# Altium schematic sheet Board-RS485.SchDoc: =ProjectTitle
size 297 x 209 mm; Address1: Address1; Address2: Address2; Address3: Address3; Address4: Address4; SheetNumber: 2; SheetTotal: 6; Scale: 1:1; DocumentType: Схема электрическая принципиальная
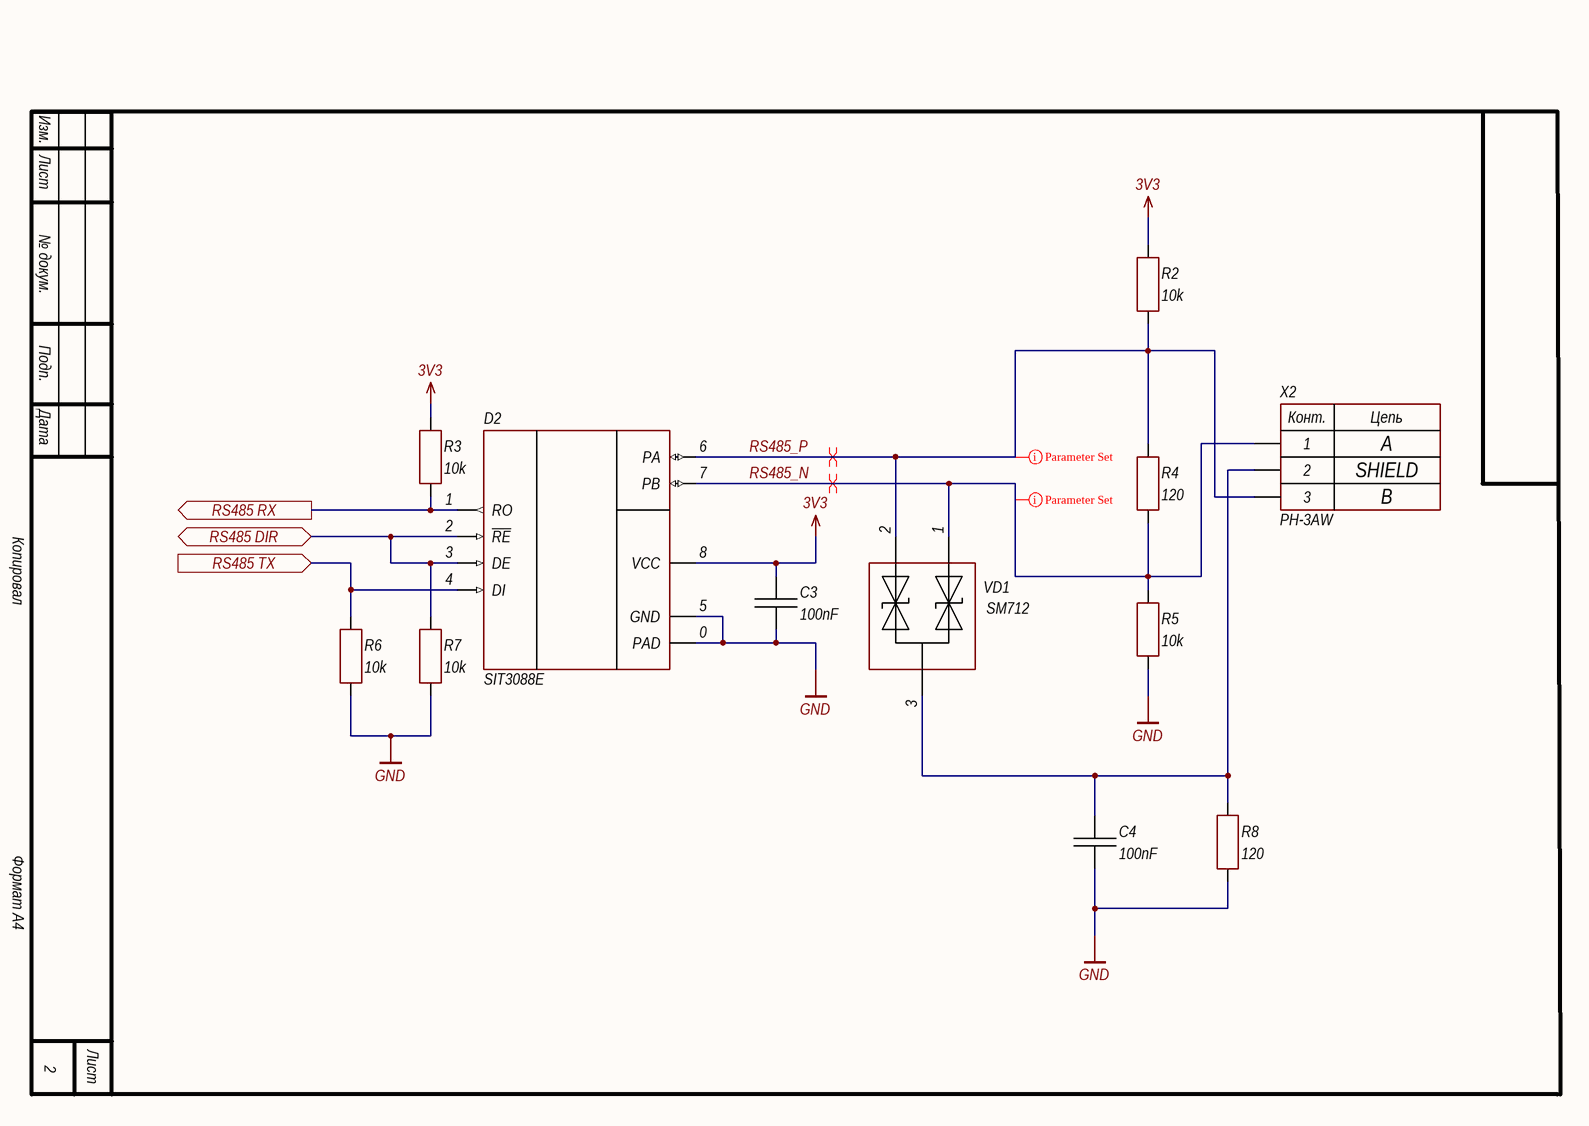
[diagram p0: Board-RS485.SchDoc]

## Parts
C3  100nF  [CH0402C]
C4  100nF  [CH0402C]
D2  SIT3088E  [8-DFN (3x3 mm, 0.65mm pitch)]
R2  10k  [CH0402R]
R3  10k  [CH0402R]
R4  120  [CH0402R]
R5  10k  [CH0402R]
R6  10k  [CH0402R]
R7  10k  [CH0402R]
R8  120  [CH0402R]
VD1  SM712  [SOT23_132]
X2  PH-3AW  [CON: PH-3AW]

## Ports
RS485 DIR (bidir), RS485 RX (out), RS485 TX (in)

## Nets
3V3: C3.2 D2.8(VCC) R2.2 R3.2
GND: C3.1 C4.1 D2.0(PAD) D2.5(GND) R5.1 R6.1 R7.1 R8.1
RS485 DIR: D2.2(~{RE}) D2.3(DE) R7.2 ; port RS485 DIR
RS485 RX: D2.1(RO) R3.1 ; port RS485 RX
RS485 TX: D2.4(DI) R6.2 ; port RS485 TX
RS485_N: D2.7(PB) R4.1 R5.2 VD1.1 X2.1
RS485_P: D2.6(PA) R2.1 R4.2 VD1.2 X2.3
NetC4_2: C4.2 R8.2 VD1.3 X2.2

## Layout directives
differential pair: RS485_N, RS485_P
rule Matched Net Lengths [Tolerance = 0.05mm]; net class RS485: RS485_N, RS485_P

## Notes on the sheet
- SHIELD
- A
- B
- Изм.
- Лист
- № докум.
- Подп.
- Дата
- Копировал
- Формат А4
- (in symbol 3-Connector) Конт.; Цепь

## Library data of the parts
C3 C4 = Capacitor: Manufacturer: CCTC; Model: TCC0402X7R104K250AT; HelpURL: https://lcsc.com/product-detail/Multilayer-Ceramic-Capacitors-MLCC-SMD-SMT_CCTC-TCC0402X7R104K250AT_C466234.html; ComponentKind: X7R, 50V; Value: 100nF
D2 = SIT3088E: RS485/RS422; Manufacturer: SIT; Model: SIT3088E; HelpURL: https://lcsc.com/product-detail/RS-485-RS-422-ICs_SIT-SIT3088ETK_C601076.html; ComponentKind: 3-5.5V, 1/8
R2 R3 R5-R7 = Resistor: Manufacturer: Uniroyal Elec; Model: 0402WGF1002TCE; HelpURL: https://lcsc.com/product-detail/Chip-Resistor-Surface-Mount_UNI-ROYAL-Uniroyal-Elec-0402WGF1002TCE_C25744.html; ComponentKind: ±1%; Value: 10k
R4 R8 = Resistor: Manufacturer: YAGEO; Model: RC0402FR-07120RL; HelpURL: https://lcsc.com/product-detail/Chip-Resistor-Surface-Mount_YAGEO-RC0402FR-07120RL_C114758.html; ComponentKind: ±1%; Value: 120
VD1 = TVS Array: Manufacturer: TECH PUBLIC; ComponentKind: 7V/12V, 150W; Model: SM712; HelpURL: https://lcsc.com/product-detail/TVS_TECH-PUBLIC-SM712_C521963.html
X2 = 3-Connector: Model: PH-3AW; Manufacturer: *; HelpURL: *; ComponentKind: *